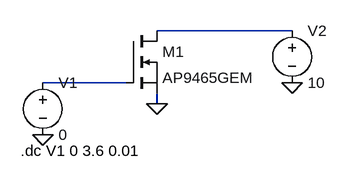
[diagram p0: schematic Входная.asc]
Входная.asc, the LTspice schematic file:
Version 4
SHEET 1 880 680
WIRE 336 128 128 128
WIRE 80 208 -48 208
WIRE 128 240 128 224
FLAG 128 240 0
FLAG -48 288 0
FLAG 336 208 0
SYMBOL nmos 80 128 R0
SYMATTR InstName M1
SYMATTR Value AP9465GEM
SYMBOL voltage -48 192 R0
SYMATTR InstName V1
SYMATTR Value 0
SYMBOL voltage 336 112 R0
SYMATTR InstName V2
SYMATTR Value 10
TEXT -82 312 Left 2 !.dc V1 0 3.6 0.01

The netlist it stands for:
* Входная.asc
M1 N001 N002 0 0 AP9465GEM
V1 N002 0 0
V2 N001 0 10
.model NMOS NMOS
.model PMOS PMOS
.lib standard.mos
.dc V1 0 3.6 0.01
.backanno
.end